# Altium schematic sheet LoraWAN_Node.SchDoc
size 635 x 381 mm; SheetNumber: 1; SheetTotal: 1
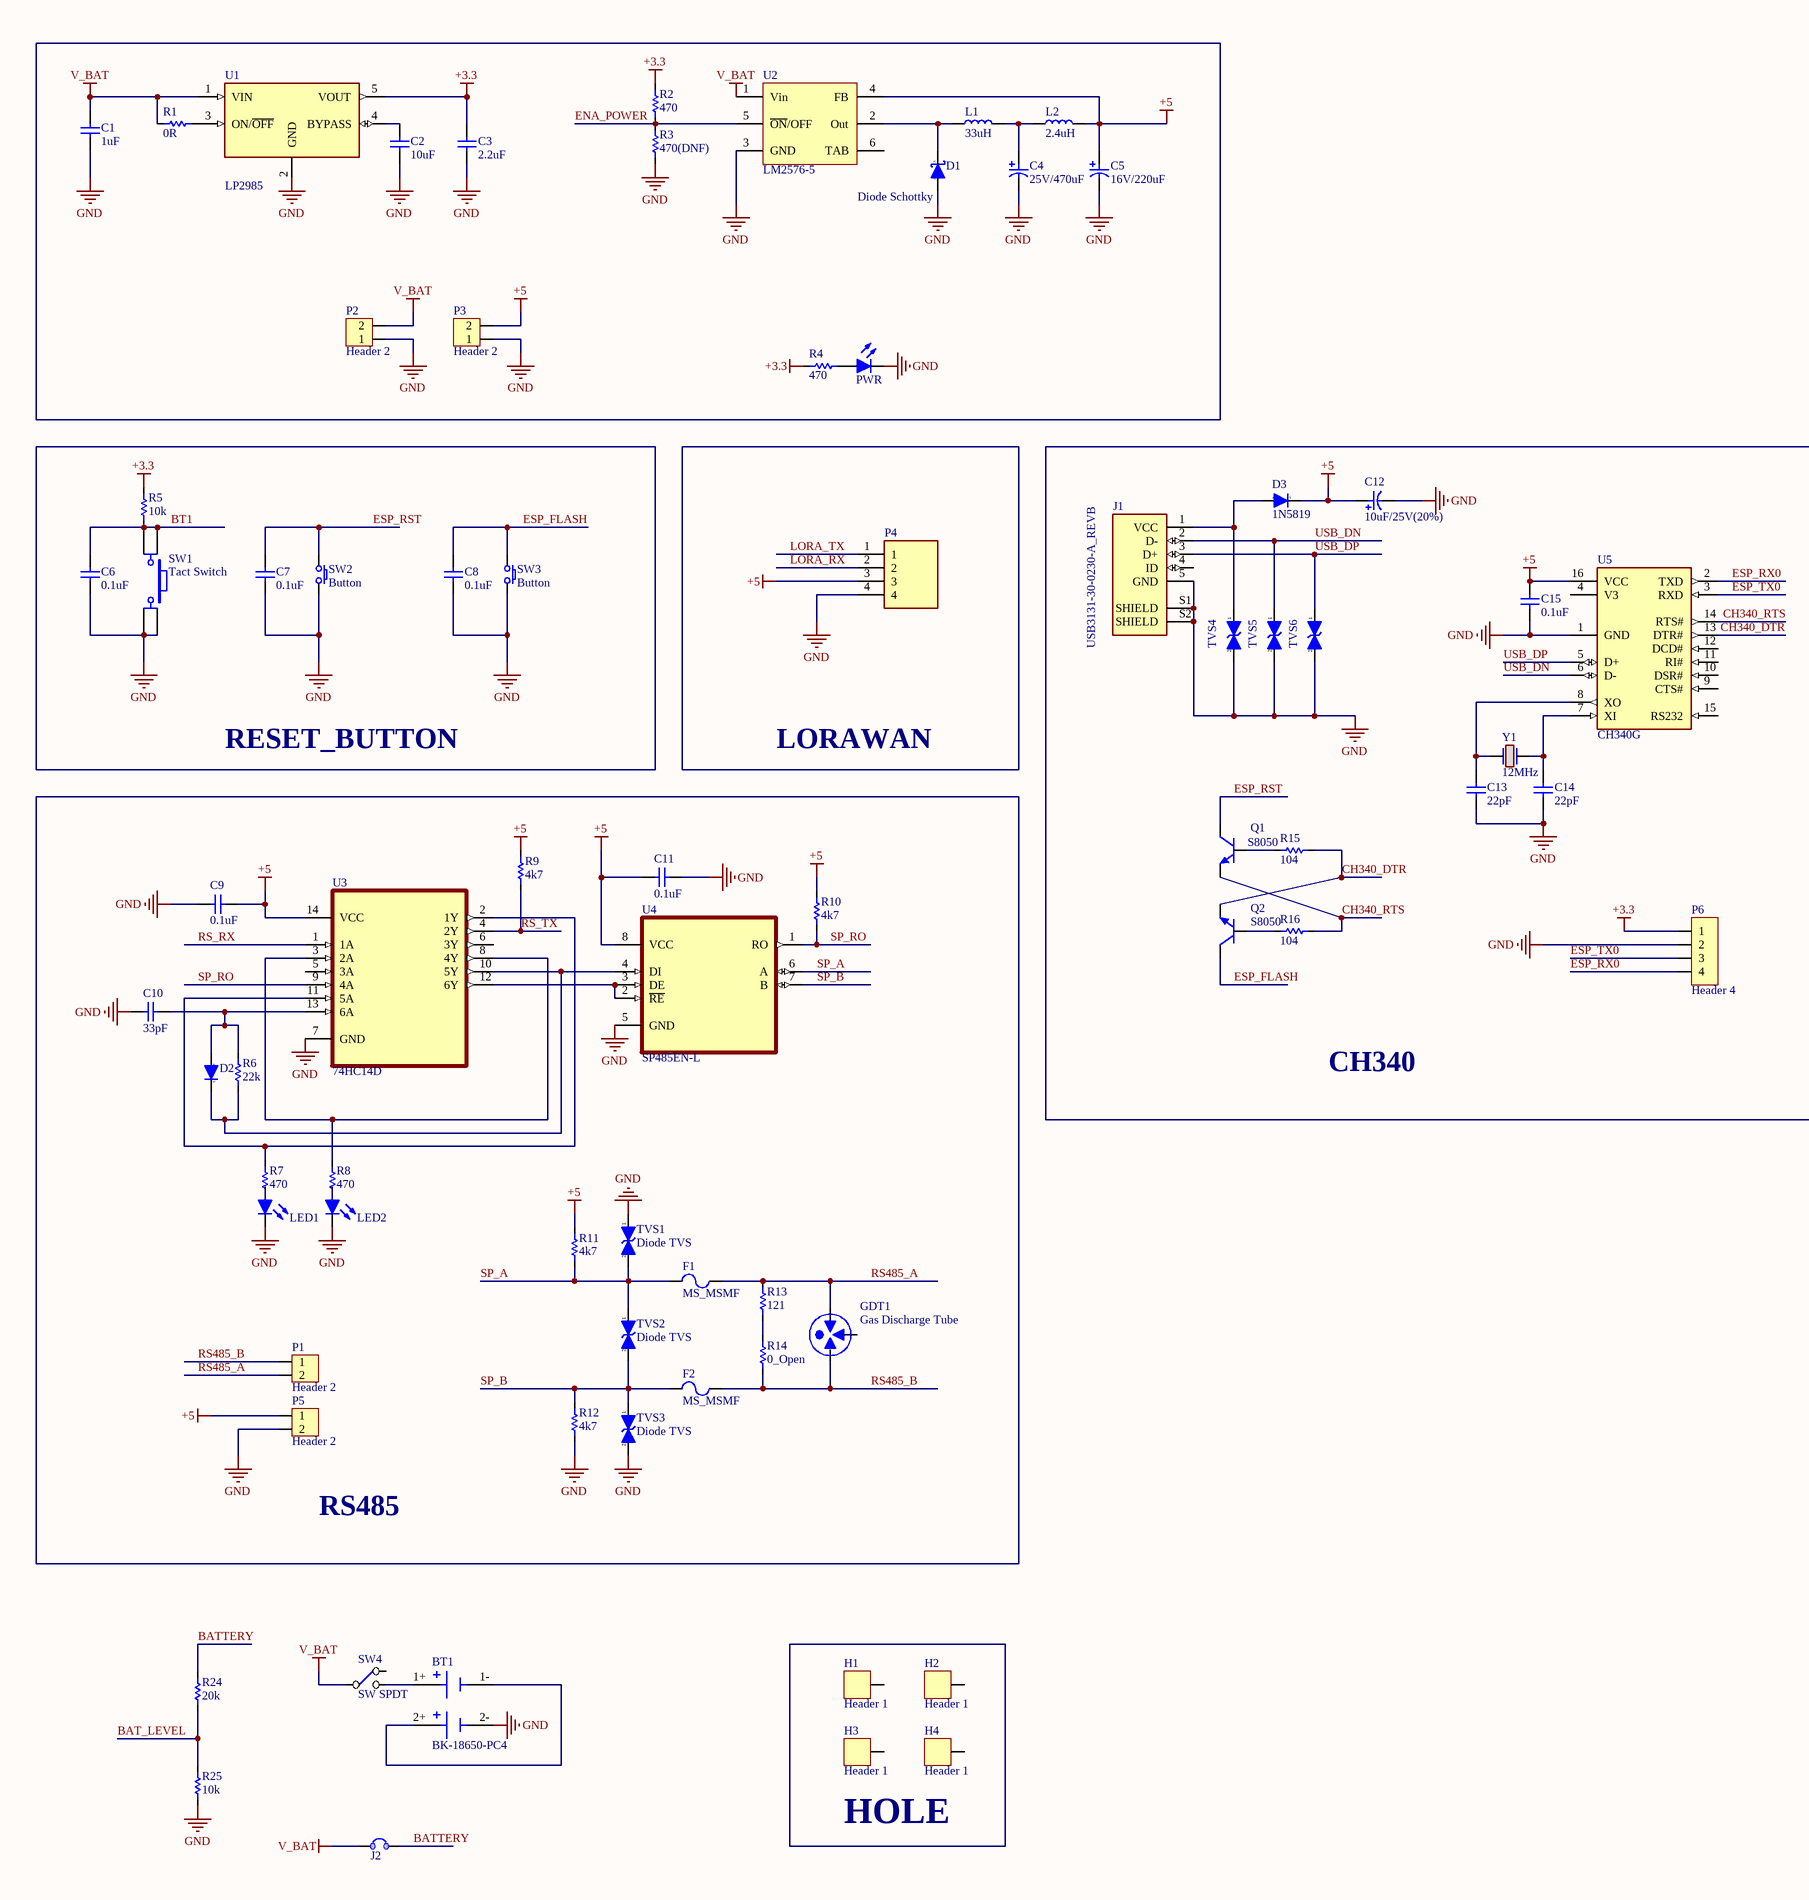
[diagram p0: LoraWAN_Node.SchDoc, left]
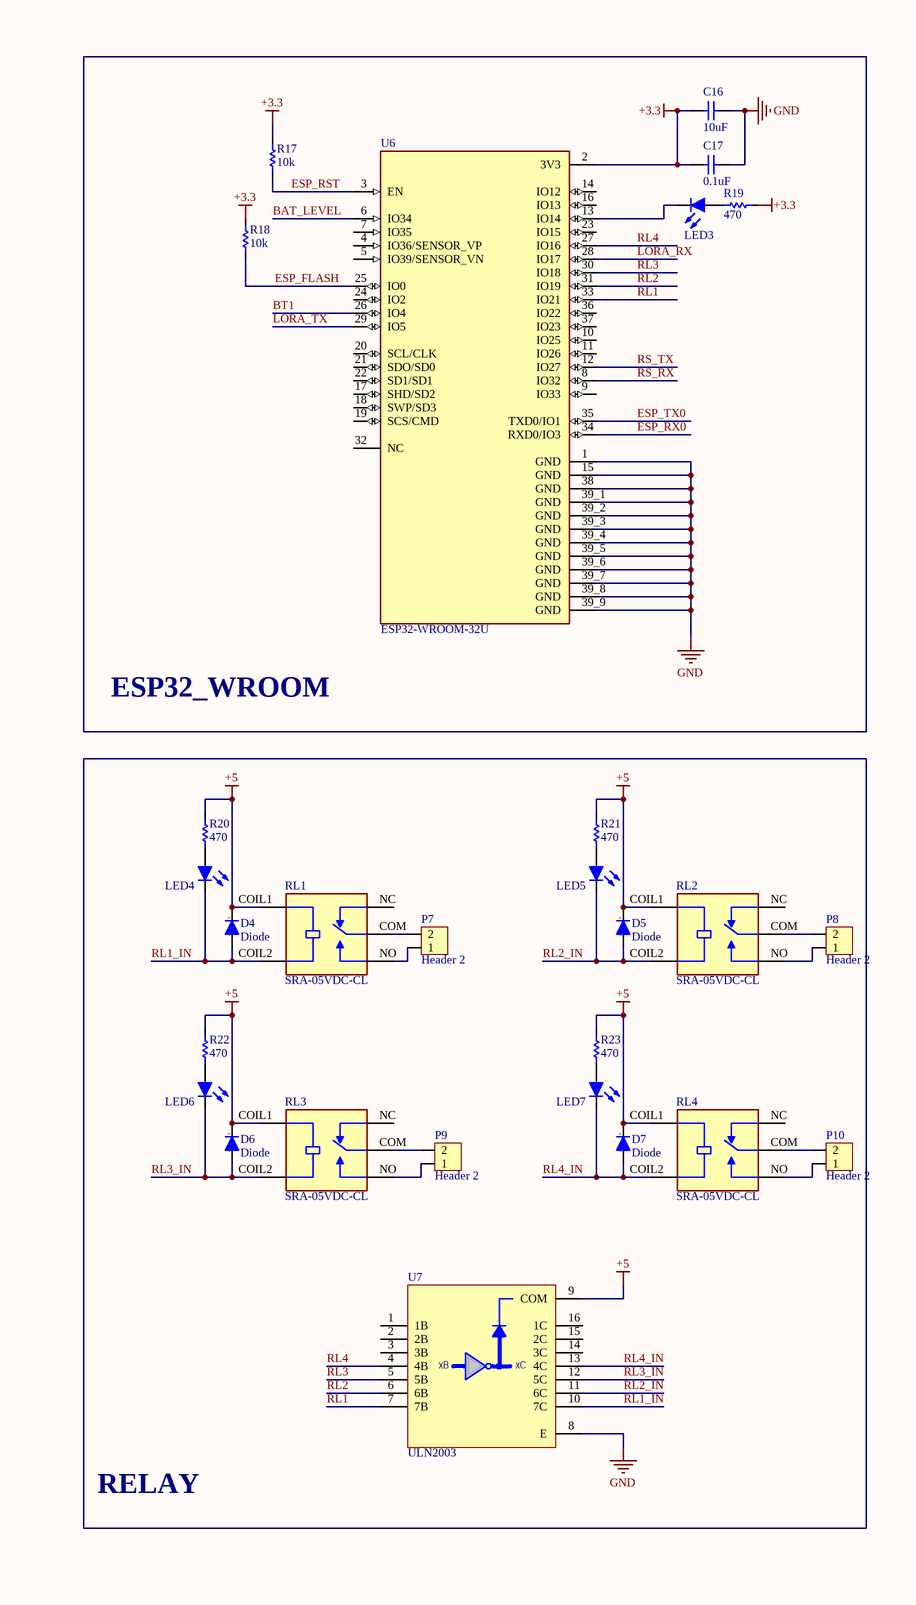
[diagram p1: LoraWAN_Node.SchDoc, right]

## Parts
BT1  BK-18650-PC4  [BAT_BK-18650-PC4]
C1  1uF  [C 0603 (1608)]
C2  10uF  [C 0603 (1608)]
C3  2.2uF  [C 0603 (1608)]
C4  25V/470uF  [C SMD ALU (G)]
C5  16V/220uF  [C SMD ALU (D8)]
C6  0.1uF  [C 0603 (1608)]
C7  0.1uF  [C 0603 (1608)]
C8  0.1uF  [C 0603 (1608)]
C9  0.1uF  [C 0603 (1608)]
C10  33pF  [C 0603 (1608)]
C11  0.1uF  [C 0603 (1608)]
C12  10uF/25V(20%)  [C SMD TAN 1206 (A)]
C13  22pF  [C 0603 (1608)]
C14  22pF  [C 0603 (1608)]
C15  0.1uF  [C 0603 (1608)]
C16  10uF  [C 0603 (1608)]
C17  0.1uF  [C 0603 (1608)]
D1  Diode Schottky  [DO-214AC (SMA)]
D2  Diode  [DO-214AC (SMA)]  (value not drawn)
D3  1N5819  [DO-214AC (SMA)]
D4  Diode  [DO-214AC (SMA)]
D5  Diode  [DO-214AC (SMA)]
D6  Diode  [DO-214AC (SMA)]
D7  Diode  [DO-214AC (SMA)]
F1  MS_MSMF  [Fuse 1812P050]
F2  MS_MSMF  [Fuse 1812P050]
GDT1  Gas Discharge Tube  [CAPC4532X110N]
H1  Header 1  [M3]
H2  Header 1  [M3]
H3  Header 1  [M3]
H4  Header 1  [M3]
J1  USB3131-30-0230-A_REVB  [GCT_USB3131-30-0230-A_REVB]
J2  JUMP 2  [JUMP/2/SMD/D]  (value not drawn)  (no BOM)
L1  33uH  [Inductor SMD 12x12x8]
L2  2.4uH  [Inductor SMD 5.2x5.8x4.5mm]
LED1  Led  [Led SMD 0805]  (value not drawn)
LED2  Led  [Led SMD 0805]  (value not drawn)
LED3  Led  [Led SMD 0805]  (value not drawn)
LED4  Led  [Led SMD 0805]  (value not drawn)
LED5  Led  [Led SMD 0805]  (value not drawn)
LED6  Led  [Led SMD 0805]  (value not drawn)
LED7  Led  [Led SMD 0805]  (value not drawn)
P1  Header 2  [HDR Domino 2 - 5MM]
P2  Header 2  [HDR Domino 2 - 5MM]
P3  Header 2  [HDR Domino 2 - 5MM]
P4  110990030  [SEEED_110990030]  (value not drawn)
P5  Header 2  [HDR Domino 2 - 5MM]
P6  Header 4  [Header 4]
P7  Header 2  [HDR Domino 2 - 5MM]
P8  Header 2  [HDR Domino 2 - 5MM]
P9  Header 2  [HDR Domino 2 - 5MM]
P10  Header 2  [HDR Domino 2 - 5MM]
PWR  Led  [Led SMD 0805]  (value not drawn)
Q1  S8050  [SOT-23]
Q2  S8050  [SOT-23]
R1  0R  [R 0603 (1608)]
R2  470  [R 0603 (1608)]
R3  470(DNF)  [R 0603 (1608)]
R4  470  [R 0603 (1608)]
R5  10k  [R 0603 (1608)]
R6  22k  [R 0603 (1608)]
R7  470  [R 0603 (1608)]
R8  470  [R 0603 (1608)]
R9  4k7  [R 0603 (1608)]
R10  4k7  [R 0603 (1608)]
R11  4k7  [R 0603 (1608)]
R12  4k7  [R 0603 (1608)]
R13  121  [R 0603 (1608)]
R14  0_Open  [R 0603 (1608)]
R15  104  [R 0603 (1608)]
R16  104  [R 0603 (1608)]
R17  10k  [R 0603 (1608)]
R18  10k  [R 0603 (1608)]
R19  470  [R 0603 (1608)]
R20  470  [R 0603 (1608)]
R21  470  [R 0603 (1608)]
R22  470  [R 0603 (1608)]
R23  470  [R 0603 (1608)]
R24  20k  [R 0603 (1608)]
R25  10k  [R 0603 (1608)]
RL1  SRA-05VDC-CL  [RELAY_SRA-05VDC-CL]
RL2  SRA-05VDC-CL  [RELAY_SRA-05VDC-CL]
RL3  SRA-05VDC-CL  [RELAY_SRA-05VDC-CL]
RL4  SRA-05VDC-CL  [RELAY_SRA-05VDC-CL]
SW1  Tact Switch  [SW/4/DIP/SMALL]
SW2  Button  [SW/2/SMD]
SW3  Button  [SW/2/SMD]
SW4  SW SPDT  [SW/3/SPDT/SS12D10]
TVS1  Diode TVS  [DO-214AA (SMB)]
TVS2  Diode TVS  [DO-214AA (SMB)]
TVS3  Diode TVS  [DO-214AA (SMB)]
TVS4  Diode TVS  [DO-214AC (SMA)]  (value not drawn)
TVS5  Diode TVS  [DO-214AC (SMA)]  (value not drawn)
TVS6  Diode TVS  [DO-214AC (SMA)]  (value not drawn)
U1  LP2985  [SOT-23-5]
U2  LM2576-5  [TO-263-5]
U3  74HC14D  [SOIC127P600X175-14N]
U4  SP485EN-L  [SOIC-8]
U5  CH340G  [SOIC-16]
U6  ESP32-WROOM-32U  [XCVR_ESP32-WROOM-32U]
U7  ULN2003  [SOIC-16]
Y1  12MHz  [Crystal HC49S DIP]

## Nets
+3.3: C3.1 C16.1 C17.1 P6.1 R2.1 R4.2 R5.2 R17.2 R18.2 R19.2 U1.5(VOUT) U6.2(3V3)
+5: C5.1 C9.2 C11.1 C12.1 C15.2 D3.1(Cathode) D4.1(Cathode) D5.1(Cathode) D6.1(Cathode) D7.1(Cathode) L2.2 P3.2 P4.3 P5.1 R9.2 R10.2 R11.2 R20.2 R21.2 R22.2 R23.2 RL1.COIL1 RL2.COIL1 RL3.COIL1 RL4.COIL1 U2.4(FB) U3.14(VCC) U4.8(VCC) U5.16(VCC) U7.9(COM)
GND: BT1.2- C1.2 C2.2 C3.2 C4.2 C5.2 C6.2 C7.2 C8.2 C9.1 C10.1 C11.2 C12.2 C13.2 C14.2 C15.1 C16.2 C17.2 D1.2(K) J1.5(GND) J1.S1(SHIELD) J1.S2(SHIELD) LED1.1(K) LED2.1(K) P2.1 P3.1 P4.4 P5.2 P6.2 PWR.1(K) R3.2 R12.1 R25.1 SW1.2 SW1.3 SW2.2 SW3.2 TVS1.1(A) TVS3.2(K) TVS4.2(K) TVS5.2(K) TVS6.2(K) U1.2(GND) U2.3(GND) U3.7(GND) U4.5(GND) U5.1(GND) U6.1(GND) U6.15(GND) U6.38(GND) U6.39_1(GND) U6.39_2(GND) U6.39_3(GND) U6.39_4(GND) U6.39_5(GND) U6.39_6(GND) U6.39_7(GND) U6.39_8(GND) U6.39_9(GND) U7.8(E)
V_BAT: C1.1 J2.1 P2.2 R1.2 SW4.2(COMMON1) U1.1(VIN) U2.1(Vin)
BAT_LEVEL: R24.1 R25.2 U6.6(IO34)
BATTERY: J2.2 R24.2
BT1: C6.1 R5.1 SW1.1 SW1.4 U6.26(IO4)
CH340_DTR: Q2.2(E) R15.2 U5.13(DTR#)
CH340_RTS: Q1.2(E) R16.2 U5.14(RTS#)
ENA_POWER: R2.2 R3.1 U2.5(~{ON}/OFF)
ESP_FLASH: C8.1 Q2.3(C) R18.1 SW3.1 U6.25(IO0)
ESP_RST: C7.1 Q1.3(C) R17.1 SW2.1 U6.3(EN)
ESP_RX0: P6.4 U5.2(TXD) U6.34(RXD0/IO3)
ESP_TX0: P6.3 U5.3(RXD) U6.35(TXD0/IO1)
LORA_RX: P4.2 U6.28(IO17)
LORA_TX: P4.1 U6.29(IO5)
RL1: U6.33(IO21) U7.7(7B)
RL1_IN: D4.2(Anode) LED4.1(K) RL1.COIL2 U7.10(7C)
RL2: U6.31(IO19) U7.6(6B)
RL2_IN: D5.2(Anode) LED5.1(K) RL2.COIL2 U7.11(6C)
RL3: U6.30(IO18) U7.5(5B)
RL3_IN: D6.2(Anode) LED6.1(K) RL3.COIL2 U7.12(5C)
RL4: U6.27(IO16) U7.4(4B)
RL4_IN: D7.2(Anode) LED7.1(K) RL4.COIL2 U7.13(4C)
RS485_A: F1.2 GDT1.1 P1.2 R13.1
RS485_B: F2.2 GDT1.2 P1.1 R14.2
RS_RX: U3.1(1A) U6.8(IO32)
RS_TX: R9.1 U3.4(2Y) U6.12(IO27)
SP_A: F1.1 R11.1 TVS1.2(K) TVS2.1(A) U4.6(A)
SP_B: F2.1 R12.2 TVS2.2(K) TVS3.1(A) U4.7(B)
SP_RO: R10.1 U3.9(4A) U4.1(RO)
USB_DN: J1.2(D-) TVS5.1(A) U5.6(D-)
USB_DP: J1.3(D+) TVS6.1(A) U5.5(D+)
NetBT1_1+: BT1.1+ SW4.3(NO1)
NetBT1_1-: BT1.1- BT1.2+
NetC2_1: C2.1 U1.4(BYPASS)
NetC4_1: C4.1 L1.2 L2.1
NetC10_2: C10.2 D2.2(Anode) R6.2 U3.13(6A)
NetC13_1: C13.1 U5.8(XO) Y1.1
NetC14_1: C14.1 U5.7(XI) Y1.2
NetD1_1: D1.1(A) L1.1 U2.2(Out)
NetD2_1: D2.1(Cathode) R6.1 U3.10(5Y) U4.4(DI)
NetD3_2: D3.2(Anode) J1.1(VCC) TVS4.1(A)
NetLED1_2: LED1.2(A) R7.1
NetLED2_2: LED2.2(A) R8.1
NetLED3_1: LED3.1(K) U6.13(IO14)
NetLED3_2: LED3.2(A) R19.1
NetLED4_2: LED4.2(A) R20.1
NetLED5_2: LED5.2(A) R21.1
NetLED6_2: LED6.2(A) R22.1
NetLED7_2: LED7.2(A) R23.1
NetP7_1: P7.1 RL1.NO
NetP7_2: P7.2 RL1.COM
NetP8_1: P8.1 RL2.NO
NetP8_2: P8.2 RL2.COM
NetP9_1: P9.1 RL3.NO
NetP9_2: P9.2 RL3.COM
NetP10_1: P10.1 RL4.NO
NetP10_2: P10.2 RL4.COM
NetPWR_2: PWR.2(A) R4.1
NetQ1_1: Q1.1(B) R15.1
NetQ2_1: Q2.1(B) R16.1
NetR1_1: R1.1 U1.3(ON/~{OFF})
NetR7_2: R7.2 U3.2(1Y) U3.11(5A)
NetR8_2: R8.2 U3.3(2A) U3.8(4Y)
NetR13_2: R13.2 R14.1
NetU3_12: U3.12(6Y) U4.2(~{RE}) U4.3(DE)

Not connected (* = marked no-connect by the designer): GDT1 3; H1 1; H2 1; H3 1; H4 1; J1 4(ID); RL1 NC; RL2 NC; RL3 NC; RL4 NC; SW4 1(NC1); U2 6(TAB); U3 5(3A) 6(3Y); U5 4(V3) 9(CTS#) 10(DSR#) 11(RI#) 12(DCD#) 15(RS232); U6 4(IO36/SENSOR_VP) 5(IO39/SENSOR_VN) 7(IO35) 9(IO33) 10(IO25) 11(IO26) 14(IO12) 16(IO13) 17(SHD/SD2) 18(SWP/SD3) 19(SCS/CMD) 20(SCL/CLK) 21(SDO/SD0) 22(SD1/SD1) 23(IO15) 24(IO2) 32(NC) 36(IO22) 37(IO23); U7 1(1B) 2(2B) 3(3B) 14(3C) 15(2C) 16(1C)

## Notes on the sheet
- ESP32_WROOM
- RESET_BUTTON
- LORAWAN
- CH340
- RS485
- RELAY
- HOLE
- (in symbol Diode) a; k
- (in symbol Diode Schottky) k; a
- (in symbol ULN2003) xB; xC

## Library data of the parts
BT1 = BK-18650-PC4: Battery Holder (Open) 18650 2 Cell PC Pin; Price: None; Value: *; Package: None; Availability: Unavailable; MP: BK-18650-PC4
C1-C3 C6-C11 C13-C17 = Capacitor NP: Capacitor non-pol
C4 C5 C12 = Capacitor: Capacitor pol
D1 = Diode Schottky: Schottky Diode; Published: 8-Jun-2000; LatestRevisionDate: 17-Jul-2002; LatestRevisionNote: Re-released for DXP Platform.; PackageReference: SMB; Publisher: Altium Limited; Code_JEDEC: DO-214-AA
D2-D7 = Diode: Default Diode; Published: 8-Jun-2000; LatestRevisionDate: 17-Jul-2002; LatestRevisionNote: Re-released for DXP Platform.; PackageVersion: Sep-1996; PackageReference: SMC; Publisher: Altium Limited; Code_JEDEC: DO-214-AB
F1 F2 = Fuse
H1-H4 = Header 1: Header, 1-Pin; LatestRevisionDate: 17-Jul-2002; LatestRevisionNote: Re-released for DXP Platform.; Publisher: Altium Limited
J1 = USB3131-30-0230-A_REVB: USB - micro B USB 2.0 Receptacle Connector 5 Position Through Hole; Availability: Unavailable; MP: USB3131-30-0230-A_REVB; Value: *; Package: None; Price: None
L1 L2 = Inductor
LED1-LED7 PWR = Led: Typical LED
P1-P3 P5 P7-P10 = Header 2: Header, 2-Pin; LatestRevisionDate: 17-Jul-2002; LatestRevisionNote: Re-released for DXP Platform.; Publisher: Altium Limited
P4 = 110990030: MF: Seeed Technology; Arrow_Electronics-Purchase-URL: https://snapeda.com/shop?store=Arrow+Electronics&id=583576; Availability: Good; Package: None; Price: None; Mouser-Purchase-URL: https://snapeda.com/shop?store=Mouser&id=583576; MP: 110990030; SnapEDA_Link: https://www.snapeda.com/parts/110990030/Seeed%20Technology%20Co.,%20Ltd/view-part/583576/?ref=snap; Value: *; Check_prices: https://www.snapeda.com/parts/110990030/Seeed%20Technology%20Co.,%20Ltd/view-part/583576/?ref=eda
P6 = Header 4: Header, 4-Pin
Q1 Q2 = Transistor NPN: NPN Bipolar Transistor
R1-R25 = Resistor: Published: 8-Jun-2000; LatestRevisionDate: 17-Jul-2002; LatestRevisionNote: Re-released for DXP Platform.; PackageReference: AXIAL-0.3; Publisher: Altium Limited
RL1-RL4 = SRA-05VDC-CL: MF: Songle Relay; SnapEDA_Link: https://www.snapeda.com/parts/SRA-05VDC-CL/Songle+Relay/view-part/?ref=snap; Package: Package; Value: *; MP: SRA-05VDC-CL; Check_prices: https://www.snapeda.com/parts/SRA-05VDC-CL/Songle+Relay/view-part/?ref=eda
SW1 = SW SPST-4: Tact switch 4 pin
SW2 SW3 = SW SPST: Tact switch 2 pin
TVS1-TVS6 = Diode TVS Bi-Dir: Bi-directional TVS Diode; Published: 8-Jun-2000; LatestRevisionDate: 17-Jul-2002; LatestRevisionNote: Re-released for DXP Platform.; PackageReference: DIODE-0.7; Publisher: Altium Limited
U1 = LP2985: LP2985 150-mA, Low-noise 30 μV(RMS) With 10-nF Bypass Capacitor, Low-dropout Regulator 280mV@150mA, With Shutdown 0.01μA Typ
U2 = LM2576/96: SIMPLE SWITCHER® 3A Step-Down Voltage Regulator
U3 = 74HC14D: Inverter IC 6 Channel Schmitt Trigger 14-SOIC; MF: Toshiba; SnapEDA_Link: https://www.snapeda.com/parts/74HC14D/Toshiba+Semiconductor+and+Storage/view-part/?ref=snap; Availability: In Stock; Price: None; Package: SO14-14 Nexperia USA Inc.; Purchase-URL: https://pricing.snapeda.com/search/part/74HC14D/?ref=eda; Check_prices: https://www.snapeda.com/parts/74HC14D/Toshiba+Semiconductor+and+Storage/view-part/?ref=eda; Value: *; MP: 74HC14D
U4 = SP485EN-L: SP485 Series 5 Mbps 5 V Low Power Half Duplex RS-485 Transceiver - NSOIC-8; MF: MaxLinear, Inc.; MP: SP485EN-L; SnapEDA_Link: https://www.snapeda.com/parts/SP485EN-L/MaxLinear%252C+Inc./view-part/?ref=snap; Availability: In Stock; Package: SOIC-8 Exar; Check_prices: https://www.snapeda.com/parts/SP485EN-L/MaxLinear%252C+Inc./view-part/?ref=eda; Value: *; Purchase-URL: https://pricing.snapeda.com/search/part/SP485EN-L/?ref=eda; Price: None
U6 = ESP32-WROOM-32U: Bluetooth, WiFi 802.11b/g/n, Bluetooth v4.2 +EDR, Class 1, 2 and 3 Transceiver Module 2.4GHz ~ 2.5GHz Antenna Not Included, U.FL Surface Mount; MF: Espressif Systems; SnapEDA_Link: https://www.snapeda.com/parts/ESP32-WROOM-32U/Espressif+Systems/view-part/?ref=snap; Package: NON STANDARD-39 Espressif; Value: *; MP: ESP32-WROOM-32U; Check_prices: https://www.snapeda.com/parts/ESP32-WROOM-32U/Espressif+Systems/view-part/?ref=eda
U7 = ULN2003: High-voltage, high-current Darlington transistor arrays
Y1 = Crystal